# EasyEDA Pro project STM Embedded BD.eprj, board PCB2
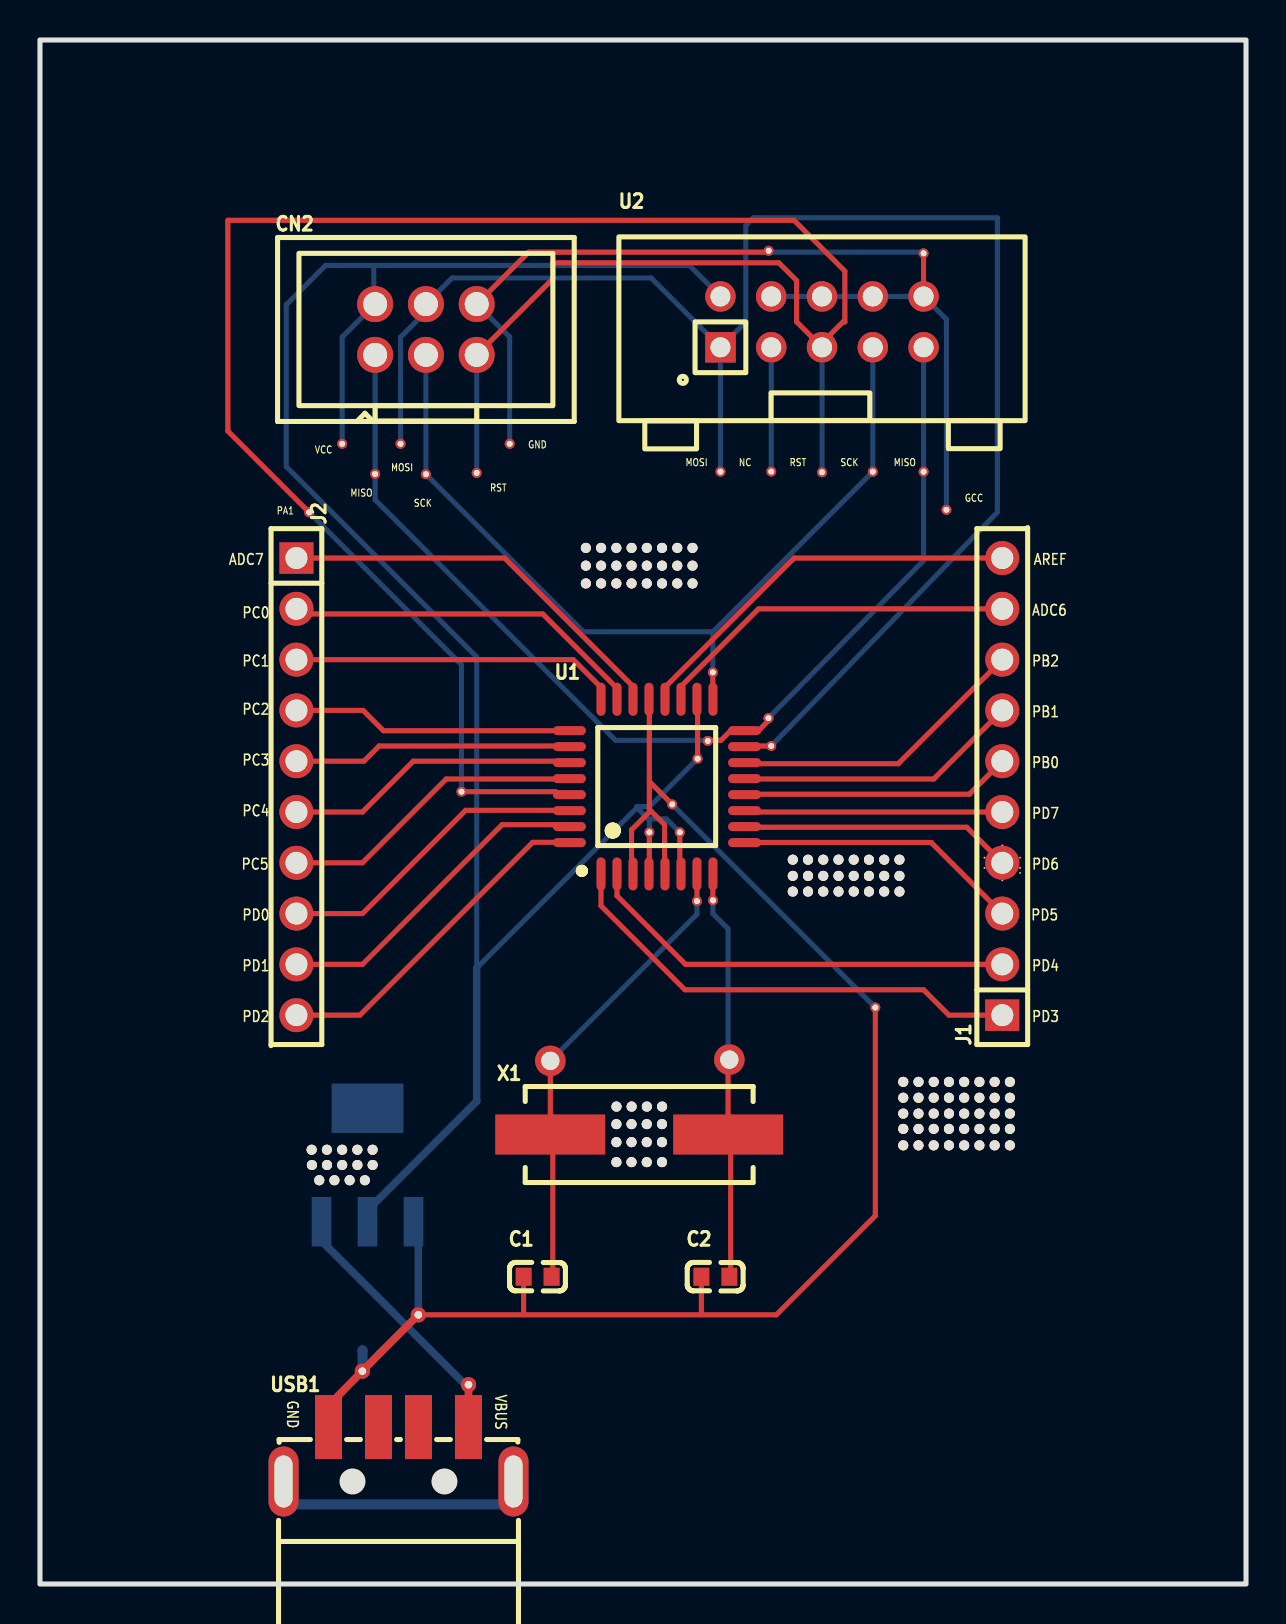
[diagram p4: board, top side]
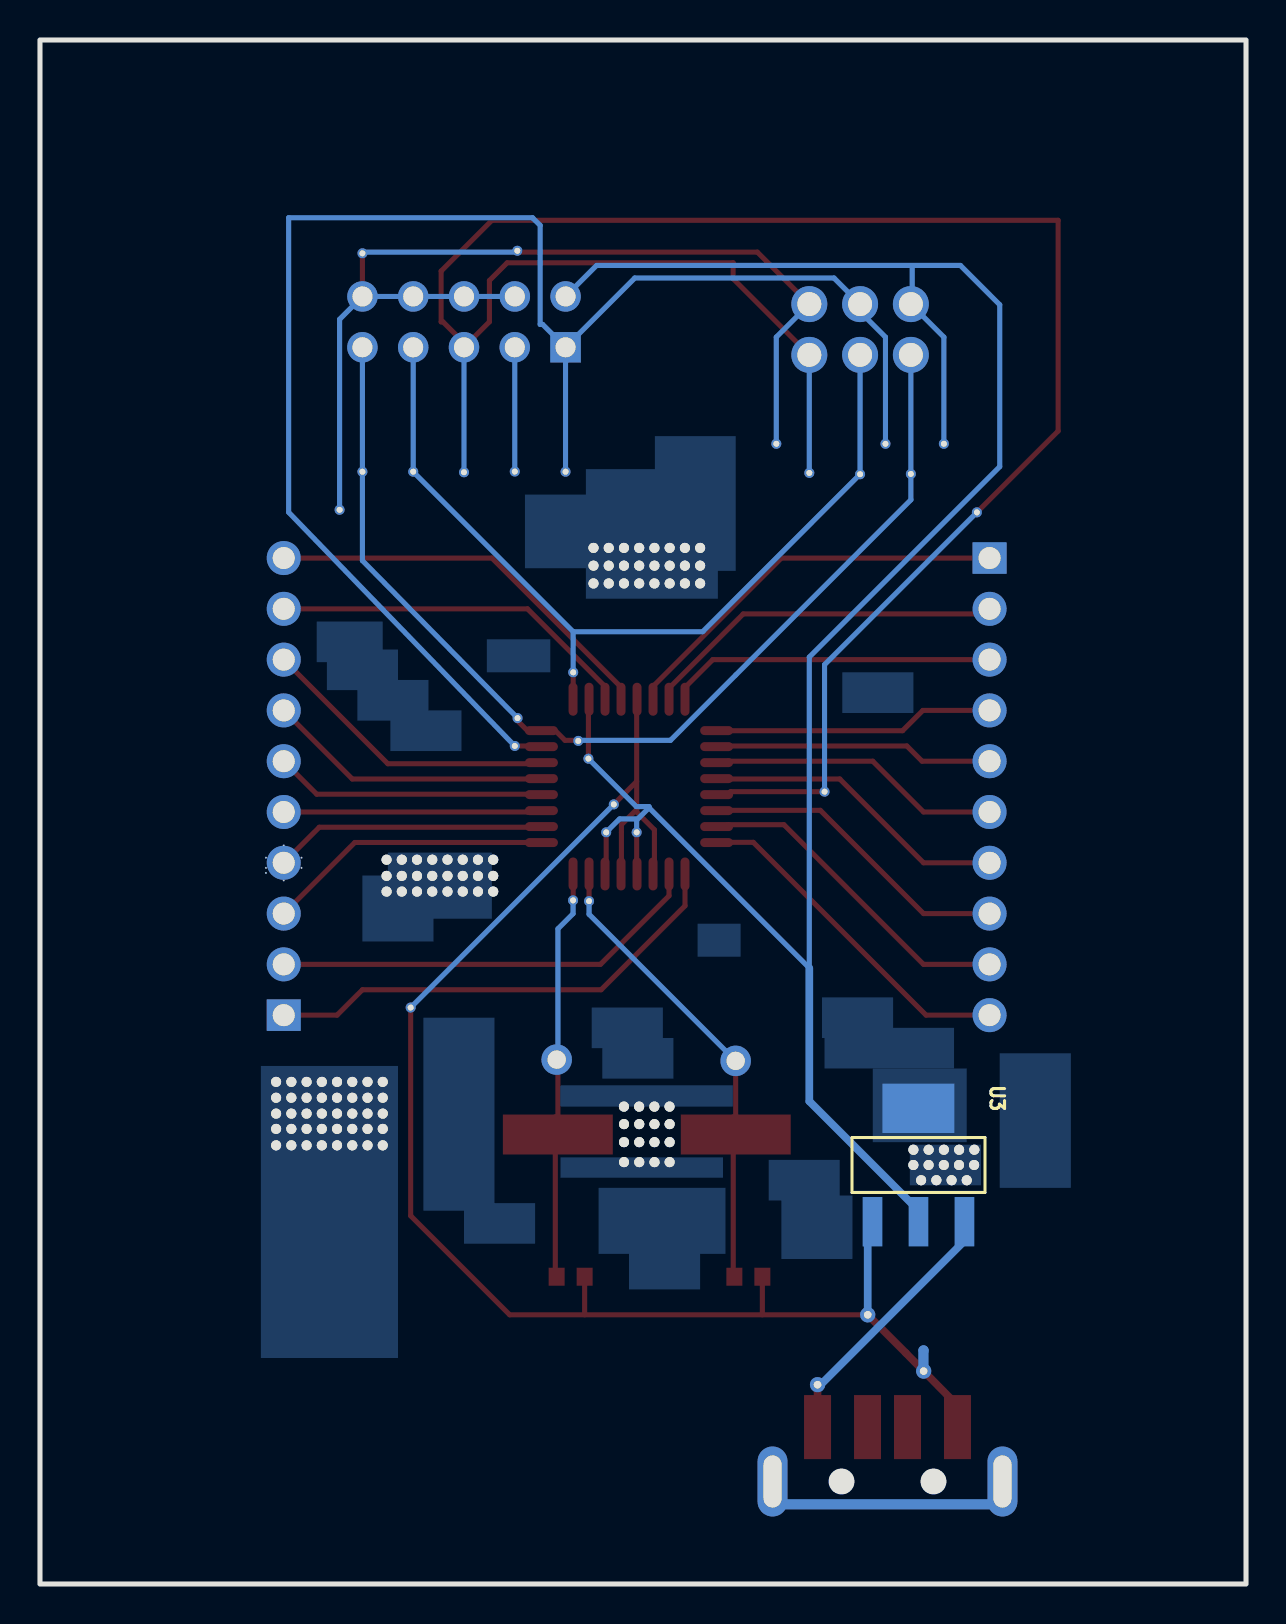
[diagram p5: board, bottom side, seen from below]

Outline 60.32 x 77.22 mm; copper layers: Top Layer, Bottom Layer. Coordinates in mm from the lower left corner of the outline.
Outline path: rectangle 0,77.22 60.32,0
Stack: Top Layer 0.035mm - / Dielectric1 1.51mm FR4 er 4.5 / Bottom Layer 0.035mm -

## Design rules (mm)
template: JLCPCB Capability(Two Layers Board)
spacing copperThickness1oz (default): track to track 0.102, other pairs 0.152 to 0.3
spacing copperThickness2oz: track to track 0.203, other pairs 0.152 to 0.3
track width copperThickness1oz (default): min 0.127, default 0.254, max 2.54
track width copperThickness2oz: min 0.203, default 0.254, max 2.54
differential pair differentialPair (default): width min 0.127, default 0.254, max 2.54; gap min 0.152, default 0.152
via viaSize (default): diameter min 0.5, default 0.61, max 10; hole min 0.3, default 0.305, max 6.3

## Placement (name value [footprint] x y rotation side)
C1  22pF  [C0603]  24.89 15.37 0 top
C2  22pF  [C0603]  33.78 15.37 0 top
CN2  75869-131LF  [CONN-TH_6P-P2.54_75869-131LF]  19.3 62.74 0 top
J1  PZ254-1-10-Z-8.5  [HDR-TH_10P-P2.54-V-M]  48.13 39.88 90 top
J2  PZ254-1-10-Z-8.5  [HDR-TH_10P-P2.54-V-M]  12.83 39.88 270 top
NOREF  -  [Pad_e2451]  42.99 35.41 0 top
NOREF#2  -  [Pad_e2455]  39.94 34.63 0 top
NOREF#3  -  [Pad_e2405]  28.07 50.93 0 top
NOREF#4  -  [Pad_e179]  33.66 45.59 0 top
NOREF#5  -  [Pad_e2469]  43.94 25.11 0 top
NOREF#6  -  [Pad_e2512]  15.11 21.72 0 top
NOREF#7  -  [Pad_e2476]  43.18 24.32 0 top
NOREF#8  -  [Pad_e643]  49.02 36.32 0 top
NOREF#9  -  [Pad_e2496]  46.23 22.76 0 top
NOREF#10  -  [Pad_e2490]  47.75 23.52 0 top
NOREF#11  -  [Pad_e2533]  31.11 23 0 top
NOREF#12  -  [Pad_e2535]  29.59 22.1 0 top
NOREF#13  -  [Pad_e68]  34.48 26.23 0 top
NOREF#14  -  [Pad_e644]  49.02 35.56 0 top
NOREF#15  -  [Pad_e2477]  43.94 24.32 0 top
NOREF#16  -  [Pad_e2305]  30.35 50.04 0 top
NOREF#17  -  [Pad_e2537]  31.11 22.1 0 top
NOREF#18  -  [Pad_e104]  30.48 37.59 0 top
NOREF#19  -  [Pad_e144]  36.58 55.63 0 top
NOREF#20  -  [Pad_e2306]  31.12 50.04 0 top
NOREF#21  -  [Pad_e2414]  28.83 51.82 0 top
NOREF#22  -  [Pad_e2456]  40.7 34.63 0 top
NOREF#23  -  [Pad_e2502]  44.7 21.94 0 top
NOREF#24  -  [Pad_e2505]  46.99 21.94 0 top
NOREF#25  -  [Pad_e2494]  44.7 22.76 0 top
NOREF#26  -  [Pad_e2471]  45.47 25.11 0 top
NOREF#27  -  [Pad_e2541]  31.11 21.1 0 top
NOREF#28  -  [Pad_e2516]  15.88 20.96 0 top
NOREF#29  -  [Pad_e2357]  33.66 34.19 0 top
NOREF#30  -  [Pad_e2450]  42.23 35.41 0 top
NOREF#31  -  [Pad_e186]  36.44 43.3 0 top
NOREF#32  -  [Pad_e190]  41.78 28.83 0 top
NOREF#33  -  [Pad_e60]  25.53 26.16 0 top
NOREF#34  -  [Pad_e2534]  28.83 22.1 0 top
NOREF#35  -  [Pad_e2499]  48.51 22.76 0 top
NOREF#36  -  [Pad_e2356]  32.86 34.15 0 top
NOREF#37  -  [Pad_e2540]  30.35 21.1 0 top
NOREF#38  -  [Pad_e2302]  28.83 50.04 0 top
NOREF#39  -  [Pad_e2406]  28.83 50.93 0 top
NOREF#40  -  [Pad_e2479]  45.47 24.32 0 top
NOREF#41  -  [Pad_e2513]  15.88 21.72 0 top
NOREF#42  -  [Pad_e158]  23.5 57.02 0 top
NOREF#43  -  [Pad_e2480]  46.23 24.32 0 top
NOREF#44  -  [Pad_e2417]  31.12 51.82 0 top
NOREF#45  -  [Pad_e2474]  47.75 25.11 0 top
NOREF#46  -  [Pad_e2459]  42.99 34.63 0 top
NOREF#47  -  [Pad_e2517]  16.64 20.96 0 top
NOREF#48  -  [Pad_e2446]  39.18 35.41 0 top
NOREF#49  -  [Pad_e2507]  48.51 21.94 0 top
NOREF#50  -  [Pad_e2538]  28.83 21.1 0 top
NOREF#51  -  [Pad_e2526]  28.84 23.88 0 top
NOREF#52  -  [Pad_e203]  36.45 66.68 0 top
NOREF#53  -  [Pad_e171]  39.12 55.6 0 top
NOREF#54  -  [Pad_e151]  45.34 53.72 0 top
NOREF#55  -  [Pad_e123]  15.11 57.02 0 top
NOREF#56  -  [Pad_e2491]  48.51 23.52 0 top
NOREF#57  -  [Pad_e2410]  31.88 50.93 0 top
NOREF#58  -  [Pad_e2404]  27.31 50.93 0 top
NOREF#59  -  [Pad_e2495]  45.47 22.76 0 top
NOREF#60  -  [Pad_e2458]  42.23 34.63 0 top
NOREF#61  -  [Pad_e2483]  48.51 24.32 0 top
NOREF#62  -  [Pad_e2485]  43.94 23.52 0 top
NOREF#63  -  [Pad_e2444]  37.66 35.41 0 top
NOREF#64  -  [Pad_e2497]  46.99 22.76 0 top
NOREF#65  -  [Pad_e2418]  31.88 51.82 0 top
NOREF#66  -  [Pad_e2409]  31.12 50.93 0 top
NOREF#67  -  [Pad_e2472]  46.23 25.11 0 top
NOREF#68  -  [Pad_e2520]  16.25 20.19 0 top
NOREF#69  -  [Pad_e2504]  46.23 21.94 0 top
NOREF#70  -  [Pad_e2503]  45.47 21.94 0 top
NOREF#71  -  [Pad_e2412]  27.31 51.82 0 top
NOREF#72  -  [Pad_e2445]  38.42 35.41 0 top
NOREF#73  -  [Pad_e2448]  40.7 35.41 0 top
NOREF#74  -  [Pad_e2468]  43.18 25.11 0 top
NOREF#75  -  [Pad_e2478]  44.7 24.32 0 top
NOREF#76  -  [Pad_e646]  48.13 36.94 0 top
NOREF#77  -  [Pad_e2528]  30.36 23.88 0 top
NOREF#78  -  [Pad_e2416]  30.35 51.82 0 top
NOREF#79  -  [Pad_e2492]  43.18 22.76 0 top
NOREF#80  -  [Pad_e84]  18.92 13.46 0 top
NOREF#81  -  [Pad_e642]  47.24 36.32 0 top
NOREF#82  -  [Pad_e2408]  30.35 50.93 0 top
NOREF#83  -  [Pad_e2498]  47.75 22.76 0 top
NOREF#84  -  [Pad_e210]  13.46 53.59 0 top
NOREF#85  -  [Pad_e2413]  28.07 51.82 0 top
NOREF#86  -  [Pad_e143]  34.04 55.63 0 top
NOREF#87  -  [Pad_e2539]  29.59 21.1 0 top
NOREF#88  -  [Pad_e2530]  28.83 23 0 top
NOREF#89  -  [Pad_e2527]  29.59 23.88 0 top
NOREF#90  -  [Pad_e2424]  40.7 36.22 0 top
NOREF#91  -  [Pad_e2422]  39.18 36.22 0 top
NOREF#92  -  [Pad_e2308]  32.64 50.04 0 top
NOREF#93  -  [Pad_e124]  18.03 57.02 0 top
NOREF#94  -  [Pad_e645]  48.13 35.19 0 top
NOREF#95  -  [Pad_e2415]  29.59 51.82 0 top
NOREF#96  -  [Pad_e191]  31.62 38.99 0 top
NOREF#97  -  [Pad_e2487]  45.47 23.52 0 top
NOREF#98  -  [Pad_e2473]  46.99 25.11 0 top
NOREF#99  -  [Pad_e213]  21.08 39.62 0 top
NOREF#100  -  [Pad_e185]  33.4 42.16 0 top
NOREF#101  -  [Pad_e2475]  48.51 25.11 0 top
NOREF#102  -  [Pad_e2511]  14.36 20.96 0 top
NOREF#103  -  [Pad_e2453]  38.42 34.63 0 top
NOREF#104  -  [Pad_e2514]  16.64 21.72 0 top
NOREF#105  -  [Pad_e2425]  41.47 36.22 0 top
NOREF#106  -  [Pad_e2301]  28.07 50.04 0 top
NOREF#107  -  [Pad_e2519]  15.49 20.19 0 top
NOREF#108  -  [Pad_e2420]  37.66 36.22 0 top
NOREF#109  -  [Pad_e2529]  31.12 23.88 0 top
NOREF#110  -  [Pad_e2488]  46.23 23.52 0 top
NOREF#111  -  [Pad_e82]  21.43 9.97 0 top
NOREF#112  -  [Pad_e126]  16.76 55.51 0 top
NOREF#113  -  [Pad_e2486]  44.7 23.52 0 top
NOREF#114  -  [Pad_e2423]  39.94 36.22 0 top
NOREF#115  -  [Pad_e2531]  29.59 23 0 top
NOREF#116  -  [Pad_e2421]  38.42 36.22 0 top
NOREF#117  -  [Pad_e204]  44.2 66.55 0 top
NOREF#118  -  [Pad_e129]  19.3 55.5 0 top
NOREF#119  -  [Pad_e2307]  31.88 50.04 0 top
NOREF#120  -  [Pad_e2481]  46.99 24.32 0 top
NOREF#121  -  [Pad_e2508]  13.59 21.72 0 top
NOREF#122  -  [Pad_e2470]  44.7 25.11 0 top
NOREF#123  -  [Pad_e2500]  43.18 21.94 0 top
NOREF#124  -  [Pad_e2493]  43.94 22.76 0 top
NOREF#125  -  [Pad_e150]  44.2 55.63 0 top
NOREF#126  -  [Pad_e2522]  13.97 20.19 0 top
NOREF#127  -  [Pad_e2304]  29.59 50.04 0 top
NOREF#128  -  [Pad_e2501]  43.94 21.94 0 top
NOREF#129  -  [Pad_e641]  47.24 35.81 0 top
NOREF#130  -  [Pad_e2426]  42.23 36.22 0 top
NOREF#131  -  [Pad_e2452]  37.66 34.63 0 top
NOREF#132  -  [Pad_e2407]  29.59 50.93 0 top
NOREF#133  -  [Pad_e2427]  42.99 36.22 0 top
NOREF#134  -  [Pad_e1539]  27.31 50.04 0 top
NOREF#135  -  [Pad_e2489]  46.99 23.52 0 top
NOREF#136  -  [Pad_e2454]  39.18 34.63 0 top
NOREF#137  -  [Pad_e640]  49.02 35.81 0 top
NOREF#138  -  [Pad_e2536]  30.35 22.1 0 top
NOREF#139  -  [Pad_e2518]  14.73 20.19 0 top
NOREF#140  -  [Pad_e2411]  32.64 50.93 0 top
NOREF#141  -  [Pad_e5733]  16.12 10.65 0 top
NOREF#142  -  [Pad_e102]  32 37.59 0 top
NOREF#143  -  [Pad_e2515]  15.12 20.96 0 top
NOREF#144  -  [Pad_e2482]  47.75 24.32 0 top
NOREF#145  -  [Pad_e130]  21.84 55.57 0 top
NOREF#146  -  [Pad_e148]  41.66 55.63 0 top
NOREF#147  -  [Pad_e197]  36.58 41.91 0 top
NOREF#148  -  [Pad_e2449]  41.47 35.41 0 top
NOREF#149  -  [Pad_e2532]  30.35 23 0 top
NOREF#150  -  [Pad_e2447]  39.94 35.41 0 top
NOREF#151  -  [Pad_e2419]  32.64 51.82 0 top
NOREF#152  -  [Pad_e2457]  41.47 34.63 0 top
NOREF#153  -  [Pad_e2506]  47.75 21.94 0 top
NOREF#154  -  [Pad_e103]  32.89 41.28 0 top
NOREF#155  -  [Pad_e2509]  14.35 21.72 0 top
NOREF#156  -  [Pad_e2510]  13.6 20.96 0 top
NOREF#157  -  [Pad_e2484]  43.18 23.52 0 top
U1  ATMEGA48PA-AU  [TQFP-32_L7.0-W7.0-P0.80-LS9.0-BL]  30.86 39.88 0 top
U2  1761608-3  [IDC-TH_10P-P2.54-S2.54_L9.2-W20.3]  39.12 63.12 0 top
U3  AMS1117-3.3  [SOT-223-4_L6.5-W3.5-P2.30-LS7.0-BR]  16.38 20.96 270 bottom
USB1  AM 180°  [USB-SMD_AM180]  17.93 6.49 0 top
X1  8MHz  [CRYSTAL-SMD_L11.5-W4.8-LS12.7]  29.97 22.48 0 top

## Footprints (pads in the part's own frame, mm; a bottom-side part is the same pattern mirrored in y, then rotated)
C0603
  rect 0.8x0.9 smd: 1(-0.7,0) 2(0.7,0)
CONN-TH_6P-P2.54_75869-131LF
  round 1.8 hole 1.2: 1(-2.54,-1.27) 2(-2.54,1.27) 3(0,-1.27) 4(0,1.27) 5(2.54,-1.27) 6(2.54,1.27)
CRYSTAL-SMD_L11.5-W4.8-LS12.7
  rect 5.5x2 smd: 1(-4.45,0) 2(4.45,0)
HDR-TH_10P-P2.54-V-M
  rect 1.575x1.7 hole 1.1: 1(-11.43,0)
  round 1.7 hole 1.1: 2(-8.89,0) 3(-6.35,0) 4(-3.81,0) 5(-1.27,0) 6(1.27,0) 7(3.81,0) 8(6.35,0) 9(8.89,0) 10(11.43,0)
IDC-TH_10P-P2.54-S2.54_L9.2-W20.3
  rect 1.524x1.524 hole 1: 1(-5.079,-1.272)
  round 1.524 hole 1: 2(-5.081,1.272) 3(-2.539,-1.27) 4(-2.541,1.272) 5(0.001,-1.27) 6(-0.001,1.272) 7(2.541,-1.27) 8(2.539,1.272) 9(5.081,-1.27) 10(5.079,1.272)
Pad_e60
  round 1.524 hole 0.914: 33(0,0)
Pad_e68
  round 1.524 hole 0.914: 34(0,0)
Pad_e82
  round 0.762 hole 0.381: 35(0,0)
Pad_e84
  round 0.762 hole 0.381: 36(0,0)
Pad_e102
  round 0.5 hole 0.3: 37(0,0)
Pad_e103
  round 0.5 hole 0.3: 37(0,0)
Pad_e104
  round 0.5 hole 0.3: 37(0,0)
Pad_e123
  round 0.5 hole 0.3: 38(0,0)
Pad_e124
  round 0.5 hole 0.3: 39(0,0)
Pad_e126
  round 0.5 hole 0.3: 41(0,0)
Pad_e129
  round 0.5 hole 0.3: 42(0,0)
Pad_e130
  round 0.5 hole 0.3: 43(0,0)
Pad_e143
  round 0.5 hole 0.3: 45(0,0)
Pad_e144
  round 0.5 hole 0.3: 46(0,0)
Pad_e148
  round 0.5 hole 0.3: 50(0,0)
Pad_e150
  round 0.5 hole 0.3: 52(0,0)
Pad_e151
  round 0.5 hole 0.3: 53(0,0)
Pad_e158
  round 0.5 hole 0.3: 54(0,0)
Pad_e171
  round 0.5 hole 0.3: 37(0,0)
Pad_e179
  round 0.5 hole 0.3: 40(0,0)
Pad_e185
  round 0.5 hole 0.3: 44(0,0)
Pad_e186
  round 0.5 hole 0.3: 47(0,0)
Pad_e190
  round 0.5 hole 0.3: 48(0,0)
Pad_e191
  round 0.5 hole 0.3: 49(0,0)
Pad_e197
  round 0.5 hole 0.3: 51(0,0)
Pad_e203
  round 0.5 hole 0.3: 55(0,0)
Pad_e204
  round 0.5 hole 0.3: 56(0,0)
Pad_e210
  round 0.5 hole 0.3: 57(0,0)
Pad_e213
  round 0.5 hole 0.3: 58(0,0)
Pad_e640
  round 0.102 hole 0.051: 59(0,0)
Pad_e641
  round 0.102 hole 0.051: 59(0,0)
Pad_e642
  round 0.102 hole 0.051: 59(0,0)
Pad_e643
  round 0.102 hole 0.051: 59(0,0)
Pad_e644
  round 0.102 hole 0.051: 59(0,0)
Pad_e645
  round 0.102 hole 0.051: 59(0,0)
Pad_e646
  round 0.102 hole 0.051: 59(0,0)
Pad_e1539
  round 0.5 hole 0.5: 47(0,0)
Pad_e2301
  round 0.5 hole 0.5: 47(0,0)
Pad_e2302
  round 0.5 hole 0.5: 47(0,0)
Pad_e2304
  round 0.5 hole 0.5: 47(0,0)
Pad_e2305
  round 0.5 hole 0.5: 47(0,0)
Pad_e2306
  round 0.5 hole 0.5: 47(0,0)
Pad_e2307
  round 0.5 hole 0.5: 47(0,0)
Pad_e2308
  round 0.5 hole 0.5: 47(0,0)
Pad_e2356
  round 0.5 hole 0.3: 59(0,0)
Pad_e2357
  round 0.5 hole 0.3: 59(0,0)
Pad_e2404
  round 0.5 hole 0.5: 47(0,0)
Pad_e2405
  round 0.5 hole 0.5: 47(0,0)
Pad_e2406
  round 0.5 hole 0.5: 47(0,0)
Pad_e2407
  round 0.5 hole 0.5: 47(0,0)
Pad_e2408
  round 0.5 hole 0.5: 47(0,0)
Pad_e2409
  round 0.5 hole 0.5: 47(0,0)
Pad_e2410
  round 0.5 hole 0.5: 47(0,0)
Pad_e2411
  round 0.5 hole 0.5: 47(0,0)
Pad_e2412
  round 0.5 hole 0.5: 47(0,0)
Pad_e2413
  round 0.5 hole 0.5: 47(0,0)
Pad_e2414
  round 0.5 hole 0.5: 47(0,0)
Pad_e2415
  round 0.5 hole 0.5: 47(0,0)
Pad_e2416
  round 0.5 hole 0.5: 47(0,0)
Pad_e2417
  round 0.5 hole 0.5: 47(0,0)
Pad_e2418
  round 0.5 hole 0.5: 47(0,0)
Pad_e2419
  round 0.5 hole 0.5: 47(0,0)
Pad_e2420
  round 0.5 hole 0.5: 47(0,0)
Pad_e2421
  round 0.5 hole 0.5: 47(0,0)
Pad_e2422
  round 0.5 hole 0.5: 47(0,0)
Pad_e2423
  round 0.5 hole 0.5: 47(0,0)
Pad_e2424
  round 0.5 hole 0.5: 47(0,0)
Pad_e2425
  round 0.5 hole 0.5: 47(0,0)
Pad_e2426
  round 0.5 hole 0.5: 47(0,0)
Pad_e2427
  round 0.5 hole 0.5: 47(0,0)
Pad_e2444
  round 0.5 hole 0.5: 47(0,0)
Pad_e2445
  round 0.5 hole 0.5: 47(0,0)
Pad_e2446
  round 0.5 hole 0.5: 47(0,0)
Pad_e2447
  round 0.5 hole 0.5: 47(0,0)
Pad_e2448
  round 0.5 hole 0.5: 47(0,0)
Pad_e2449
  round 0.5 hole 0.5: 47(0,0)
Pad_e2450
  round 0.5 hole 0.5: 47(0,0)
Pad_e2451
  round 0.5 hole 0.5: 47(0,0)
Pad_e2452
  round 0.5 hole 0.5: 47(0,0)
Pad_e2453
  round 0.5 hole 0.5: 47(0,0)
Pad_e2454
  round 0.5 hole 0.5: 47(0,0)
Pad_e2455
  round 0.5 hole 0.5: 47(0,0)
Pad_e2456
  round 0.5 hole 0.5: 47(0,0)
Pad_e2457
  round 0.5 hole 0.5: 47(0,0)
Pad_e2458
  round 0.5 hole 0.5: 47(0,0)
Pad_e2459
  round 0.5 hole 0.5: 47(0,0)
Pad_e2468
  round 0.5 hole 0.5: 47(0,0)
Pad_e2469
  round 0.5 hole 0.5: 47(0,0)
Pad_e2470
  round 0.5 hole 0.5: 47(0,0)
Pad_e2471
  round 0.5 hole 0.5: 47(0,0)
Pad_e2472
  round 0.5 hole 0.5: 47(0,0)
Pad_e2473
  round 0.5 hole 0.5: 47(0,0)
Pad_e2474
  round 0.5 hole 0.5: 47(0,0)
Pad_e2475
  round 0.5 hole 0.5: 47(0,0)
Pad_e2476
  round 0.5 hole 0.5: 47(0,0)
Pad_e2477
  round 0.5 hole 0.5: 47(0,0)
Pad_e2478
  round 0.5 hole 0.5: 47(0,0)
Pad_e2479
  round 0.5 hole 0.5: 47(0,0)
Pad_e2480
  round 0.5 hole 0.5: 47(0,0)
Pad_e2481
  round 0.5 hole 0.5: 47(0,0)
Pad_e2482
  round 0.5 hole 0.5: 47(0,0)
Pad_e2483
  round 0.5 hole 0.5: 47(0,0)
Pad_e2484
  round 0.5 hole 0.5: 47(0,0)
Pad_e2485
  round 0.5 hole 0.5: 47(0,0)
Pad_e2486
  round 0.5 hole 0.5: 47(0,0)
Pad_e2487
  round 0.5 hole 0.5: 47(0,0)
Pad_e2488
  round 0.5 hole 0.5: 47(0,0)
Pad_e2489
  round 0.5 hole 0.5: 47(0,0)
Pad_e2490
  round 0.5 hole 0.5: 47(0,0)
Pad_e2491
  round 0.5 hole 0.5: 47(0,0)
Pad_e2492
  round 0.5 hole 0.5: 47(0,0)
Pad_e2493
  round 0.5 hole 0.5: 47(0,0)
Pad_e2494
  round 0.5 hole 0.5: 47(0,0)
Pad_e2495
  round 0.5 hole 0.5: 47(0,0)
Pad_e2496
  round 0.5 hole 0.5: 47(0,0)
Pad_e2497
  round 0.5 hole 0.5: 47(0,0)
Pad_e2498
  round 0.5 hole 0.5: 47(0,0)
Pad_e2499
  round 0.5 hole 0.5: 47(0,0)
Pad_e2500
  round 0.5 hole 0.5: 47(0,0)
Pad_e2501
  round 0.5 hole 0.5: 47(0,0)
Pad_e2502
  round 0.5 hole 0.5: 47(0,0)
Pad_e2503
  round 0.5 hole 0.5: 47(0,0)
Pad_e2504
  round 0.5 hole 0.5: 47(0,0)
Pad_e2505
  round 0.5 hole 0.5: 47(0,0)
Pad_e2506
  round 0.5 hole 0.5: 47(0,0)
Pad_e2507
  round 0.5 hole 0.5: 47(0,0)
Pad_e2508
  round 0.5 hole 0.5: 47(0,0)
Pad_e2509
  round 0.5 hole 0.5: 47(0,0)
Pad_e2510
  round 0.5 hole 0.5: 47(0,0)
Pad_e2511
  round 0.5 hole 0.5: 47(0,0)
Pad_e2512
  round 0.5 hole 0.5: 47(0,0)
Pad_e2513
  round 0.5 hole 0.5: 47(0,0)
Pad_e2514
  round 0.5 hole 0.5: 47(0,0)
Pad_e2515
  round 0.5 hole 0.5: 47(0,0)
Pad_e2516
  round 0.5 hole 0.5: 47(0,0)
Pad_e2517
  round 0.5 hole 0.5: 47(0,0)
Pad_e2518
  round 0.5 hole 0.5: 47(0,0)
Pad_e2519
  round 0.5 hole 0.5: 47(0,0)
Pad_e2520
  round 0.5 hole 0.5: 47(0,0)
Pad_e2522
  round 0.5 hole 0.5: 47(0,0)
Pad_e2526
  round 0.5 hole 0.5: 47(0,0)
Pad_e2527
  round 0.5 hole 0.5: 47(0,0)
Pad_e2528
  round 0.5 hole 0.5: 47(0,0)
Pad_e2529
  round 0.5 hole 0.5: 47(0,0)
Pad_e2530
  round 0.5 hole 0.5: 47(0,0)
Pad_e2531
  round 0.5 hole 0.5: 47(0,0)
Pad_e2532
  round 0.5 hole 0.5: 47(0,0)
Pad_e2533
  round 0.5 hole 0.5: 47(0,0)
Pad_e2534
  round 0.5 hole 0.5: 47(0,0)
Pad_e2535
  round 0.5 hole 0.5: 47(0,0)
Pad_e2536
  round 0.5 hole 0.5: 47(0,0)
Pad_e2537
  round 0.5 hole 0.5: 47(0,0)
Pad_e2538
  round 0.5 hole 0.5: 47(0,0)
Pad_e2539
  round 0.5 hole 0.5: 47(0,0)
Pad_e2540
  round 0.5 hole 0.5: 47(0,0)
Pad_e2541
  round 0.5 hole 0.5: 47(0,0)
Pad_e5733
  round 0.762 hole 0.381: 36(0,0)
SOT-223-4_L6.5-W3.5-P2.30-LS7.0-BR
  rect 2.47x0.98 smd: 1(2.835,-2.3) 2(2.835,0) 3(2.835,2.3)
  rect 2.47x3.6 smd: 4(-2.835,0)
TQFP-32_L7.0-W7.0-P0.80-LS9.0-BL
  oval 0.45x1.65 smd: 1(-2.8,-4.369) 2(-2,-4.369) 3(-1.2,-4.369) 4(-0.4,-4.369) 5(0.4,-4.369) 6(1.2,-4.369) 7(2,-4.369) 8(2.8,-4.369) 17(2.8,4.369) 18(2,4.369) 19(1.2,4.369) 20(0.4,4.369) 21(-0.4,4.369) 22(-1.2,4.369) 23(-2,4.369) 24(-2.8,4.369)
  oval 1.65x0.45 smd: 9(4.381,-2.8) 10(4.381,-2) 11(4.381,-1.2) 12(4.381,-0.4) 13(4.381,0.4) 14(4.381,1.2) 15(4.381,2) 16(4.381,2.8) 25(-4.381,2.8) 26(-4.381,2) 27(-4.381,1.2) 28(-4.381,0.4) 29(-4.381,-0.4) 30(-4.381,-1.2) 31(-4.381,-2) 32(-4.381,-2.8)
USB-SMD_AM180
  rect 1.35x3.2 smd: 1(3.5,1.36) 2(1,1.36) 3(-1,1.36) 4(-3.5,1.36)
  oval 1.5x3.5 hole 0.9x2.6: 5(-5.75,-1.36) 5(5.75,-1.36)

## Nets
GND: C1.1 C2.1 CN2.6 NOREF.47 NOREF#2.47 NOREF#3.47 NOREF#5.47 NOREF#6.47 NOREF#7.47 NOREF#9.47 NOREF#10.47 NOREF#11.47 NOREF#12.47 NOREF#15.47 NOREF#16.47 NOREF#17.47 NOREF#20.47 NOREF#21.47 NOREF#22.47 NOREF#23.47 NOREF#24.47 NOREF#25.47 NOREF#26.47 NOREF#27.47 NOREF#28.47 NOREF#30.47 NOREF#32.48 NOREF#34.47 NOREF#35.47 NOREF#37.47 NOREF#38.47 NOREF#39.47 NOREF#40.47 NOREF#41.47 NOREF#42.54 NOREF#43.47 NOREF#44.47 NOREF#45.47 NOREF#46.47 NOREF#47.47 NOREF#48.47 NOREF#49.47 NOREF#50.47 NOREF#51.47 NOREF#52.55 NOREF#54.53 NOREF#56.47 NOREF#57.47 NOREF#58.47 NOREF#59.47 NOREF#60.47 NOREF#61.47 NOREF#62.47 NOREF#63.47 NOREF#64.47 NOREF#65.47 NOREF#66.47 NOREF#67.47 NOREF#68.47 NOREF#69.47 NOREF#70.47 NOREF#71.47 NOREF#72.47 NOREF#73.47 NOREF#74.47 NOREF#75.47 NOREF#77.47 NOREF#78.47 NOREF#79.47 NOREF#80.36 NOREF#82.47 NOREF#83.47 NOREF#85.47 NOREF#87.47 NOREF#88.47 NOREF#89.47 NOREF#90.47 NOREF#91.47 NOREF#92.47 NOREF#95.47 NOREF#96.49 NOREF#97.47 NOREF#98.47 NOREF#101.47 NOREF#102.47 NOREF#103.47 NOREF#104.47 NOREF#105.47 NOREF#106.47 NOREF#107.47 NOREF#108.47 NOREF#109.47 NOREF#110.47 NOREF#113.47 NOREF#114.47 NOREF#115.47 NOREF#116.47 NOREF#117.56 NOREF#119.47 NOREF#120.47 NOREF#121.47 NOREF#122.47 NOREF#123.47 NOREF#124.47 NOREF#126.47 NOREF#127.47 NOREF#128.47 NOREF#130.47 NOREF#131.47 NOREF#132.47 NOREF#133.47 NOREF#134.47 NOREF#135.47 NOREF#136.47 NOREF#138.47 NOREF#139.47 NOREF#140.47 NOREF#141.36 NOREF#143.47 NOREF#144.47 NOREF#148.47 NOREF#149.47 NOREF#150.47 NOREF#151.47 NOREF#152.47 NOREF#153.47 NOREF#155.47 NOREF#156.47 NOREF#157.47 U1.3 U1.5 U1.21 U2.4 U2.6 U2.8 U2.10 U3.1 USB1.4
VBUS: NOREF#111.35 U3.3 USB1.1
VCC: CN2.2 NOREF#18.37 NOREF#55.38 NOREF#142.37 NOREF#154.37 U1.4 U1.6 U1.18 U2.2 U3.2
NC: NOREF#19.46
$2N830: CN2.4 NOREF#86.45 NOREF#93.39 NOREF#147.51 U1.15 U2.1
$2N839: CN2.1 NOREF#31.47 NOREF#100.44 NOREF#112.41 NOREF#125.52 U1.16 U2.9
$2N858: CN2.3 NOREF#4.40 NOREF#118.42 NOREF#146.50 U1.17 U2.7
$2N878: CN2.5 NOREF#53.37 NOREF#84.57 NOREF#99.58 NOREF#145.43 U1.29 U2.5
$2N1111: C1.2 NOREF#33.33 NOREF#36.59 U1.7 X1.1
$2N1119: C2.2 NOREF#13.34 NOREF#29.59 U1.8 X1.2
$2N1346: J1.1 U1.1
$2N1350: J1.2 U1.2
$2N1360: J1.3 U1.9
$2N1374: J1.4 NOREF#8.59 NOREF#14.59 NOREF#76.59 NOREF#81.59 NOREF#94.59 NOREF#129.59 NOREF#137.59 U1.10
$2N1380: J1.5 U1.11
$2N1390: J1.6 U1.12
$2N1398: J1.7 U1.13
$2N1410: J1.8 U1.14
$2N1422: J1.9 U1.19
$2N1434: J1.10 U1.20
$2N1448: J2.1 U1.22
$2N1452: J2.2 U1.23
$2N1456: J2.3 U1.24
$2N1460: J2.4 U1.25
$2N1464: J2.5 U1.26
$2N1472: J2.6 U1.27
$2N1480: J2.7 U1.28
$2N1488: J2.8 U1.30
$2N1496: J2.9 U1.31
$2N1514: J2.10 U1.32

Pads without a net: U2 3; U3 4; USB1 2 3 5

## Routing (per net, layer and track width the routed paths; a pad name or vN(x,y) marks a point on that pad's centre or on a via; arc(x,y) is an arc through that point)
$2N1346: length 23.9
  Top Layer w0.254: 28.06,35.51 28.06,33.92 32.26,29.72 44.2,29.72 45.47,28.45 J1.1
$2N1350: length 21.8
  Top Layer w0.254: U1.2 28.86,34.42 32.29,30.99 J1.2
$2N1360: length 13.7
  Top Layer w0.254: 35.94,37.08 44.58,37.08 48.13,33.53
$2N1374: length 13.1
  Top Layer w0.254: 35.81,37.85 46.35,37.85 J1.4
$2N1380: length 12.4
  Top Layer w0.254: 35.81,38.74 35.94,38.61 48.13,38.61
$2N1390: length 13
  Top Layer w0.254: 35.81,39.5 46.48,39.5 J1.6
$2N1398: length 13.7
  Top Layer w0.254: 35.81,40.26 44.7,40.26 J1.7
$2N1410: length 14.5
  Top Layer w0.254: 35.81,41.02 42.93,41.02 J1.8
$2N1422: length 17.6
  Top Layer w0.254: 32.13,44.96 35.94,48.77 J1.9
$2N1434: length 19.6
  Top Layer w0.254: 31.24,44.83 37.72,51.31 48.13,51.31
$2N1448: length 19.4
  Top Layer w0.254: 12.83,51.31 23.24,51.31 29.59,44.96
$2N1452: length 17.5
  Top Layer w0.254: 12.83,48.51 25.15,48.51 28.83,44.83
$2N1456: length 15.8
  Top Layer w0.254: J2.3 26.67,46.23 28.06,44.84
$2N1460: length 13.5
  Top Layer w0.254: J2.4 16.16,43.69 17.18,42.67 25.91,42.67
$2N1464: length 13.4
  Top Layer w0.254: J2.5 16.2,41.15 16.97,41.91 25.91,41.91
$2N1472: length 14.1
  Top Layer w0.254: 12.83,38.61 16.13,38.61 18.67,41.15 25.91,41.15
$2N1480: length 14.8
  Top Layer w0.254: J2.7 16.13,36.07 20.32,40.26 25.91,40.26
$2N1488: length 15.3
  Top Layer w0.254: 12.83,33.53 16.13,33.53 21.29,38.69 25.96,38.69
$2N1496: length 16
  Top Layer w0.254: J2.9 16.13,30.99 23.11,37.97 25.91,37.97
$2N1514: length 16.7
  Top Layer w0.254: J2.10 16,28.45 24.65,37.09 25.92,37.09

## Copper pours and planes (outline as drawn; the poured copper is in the pictures)
GND on Bottom Layer: 25.28,33.02 27.43,33.02 27.43,31.37 25.28,31.37
GND on Bottom Layer: 29.17,28.83 32.73,28.83 32.73,26.8 29.17,26.8
GND on Bottom Layer: 8.76,26.54 12.32,26.54 12.32,19.81 8.76,19.81
GND on Bottom Layer: 26.16,21.34 34.29,21.34 34.29,20.32 26.16,20.32
GND on Bottom Layer: 13.26,21.97 16.81,21.97 16.81,19.94 13.26,19.94
GND on Bottom Layer: 28.64,27.31 32.2,27.31 32.2,25.27 28.64,25.27
GND on Bottom Layer: 20.32,21.21 23.88,21.21 23.88,19.18 20.32,19.18
GND on Bottom Layer: 27.31,16.76 30.86,16.76 30.86,14.73 27.31,14.73
GND on Bottom Layer: 40.89,45.21 44.45,45.21 44.45,43.18 40.89,43.18
GND on Bottom Layer: 19.69,19.43 23.24,19.43 23.24,16.26 19.69,16.26
GND on Bottom Layer: 42.42,46.74 45.97,46.74 45.97,44.7 42.42,44.7
GND on Bottom Layer: 34.8,47.24 37.97,47.24 37.97,45.59 34.8,45.59
GND on Bottom Layer: 37.59,28.32 41.15,28.32 41.15,18.67 37.59,18.67
GND on Bottom Layer: 42.42,25.91 49.28,25.91 49.28,11.3 42.42,11.3
GND on Bottom Layer: 25.53,57.4 29.57,57.4 29.57,50.67 25.53,50.67
GND on Bottom Layer: 26.03,19.81 32.38,19.81 32.38,16.51 26.03,16.51
GND on Bottom Layer: 16.64,45.59 20.19,45.59 20.19,43.56 16.64,43.56
GND on Bottom Layer: 35.56,19.05 39.12,19.05 39.12,17.02 35.56,17.02
GND on Bottom Layer: 31.88,54.48 36.07,54.48 36.07,50.8 31.88,50.8
GND on Bottom Layer: 14.6,27.81 21.08,27.81 21.08,25.78 14.6,25.78
GND on Bottom Layer: 43.18,48.13 46.48,48.13 46.48,46.1 43.18,46.1
GND on Bottom Layer: 40.64,35.43 44.2,35.43 44.2,32.13 40.64,32.13
GND on Bottom Layer: 37.72,36.58 42.93,36.58 42.93,33.27 37.72,33.27
GND on Bottom Layer: 13.97,25.78 18.67,25.78 18.67,22.1 13.97,22.1
GND on Bottom Layer: 8.25,69.6 52.7,69.6 52.7,11.3 8.25,11.3
GND on Bottom Layer: 17.65,29.34 21.21,29.34 21.21,27.31 17.65,27.31
GND on Bottom Layer: 26.42,55.75 33.02,55.75 33.02,49.28 26.42,49.28
GND on Bottom Layer: 39.24,43.69 42.8,43.69 42.8,41.66 39.24,41.66
GND on Bottom Layer: 25.66,24.94 34.29,24.94 34.29,23.88 25.66,23.88

## Text on the board
Top Silkscreen Layer: PA1 | VCC | MISO | MOSI | SCK | RST | GND | NC | GCC | ADC7 | PC5 | PC0 | PC1 | PC2 | PC3 | PC4 | PD0 | PD1 | PD2 | PD5 | ADC6 | PB2 | PB1 | PB0 | PD7 | PD6 | PD4 | PD3 | AREF | VBUS
